# Altium schematic sheet СФ МЭИ ЛБ ПЭ2-18 11.03.04 08 Э3.SchDoc
size 420 x 297 mm; Scale: 1:1; Разраб.: Попов А.Е.; Пров.: Смолин В.А.; Номер листа: 1; Общее количество листов: 1; Наименование изделия 1: Стабилизатор напряжения; Наименование изделия 2: Схема электрическая; Наименование изделия 3: принципиальная; Нач. отд.: Нач. отд.; Литера: У; Масштаб: 1:1; Децимальный номер: СФ МЭИ ЛБ ПЭ2-18 11.03.04 08 Э3; Наименование. Строка 2: для телевизора; Наименование. Строка 3: Схема электирическая принципиальная; Наименование. Строка 1: Блок питания; Разработал: Попов А.Е.; Проверил: Смолин В.А.; Утвердил: Рассказа Д.С.; Лист. Номер: 1; Лист. Всего: 1
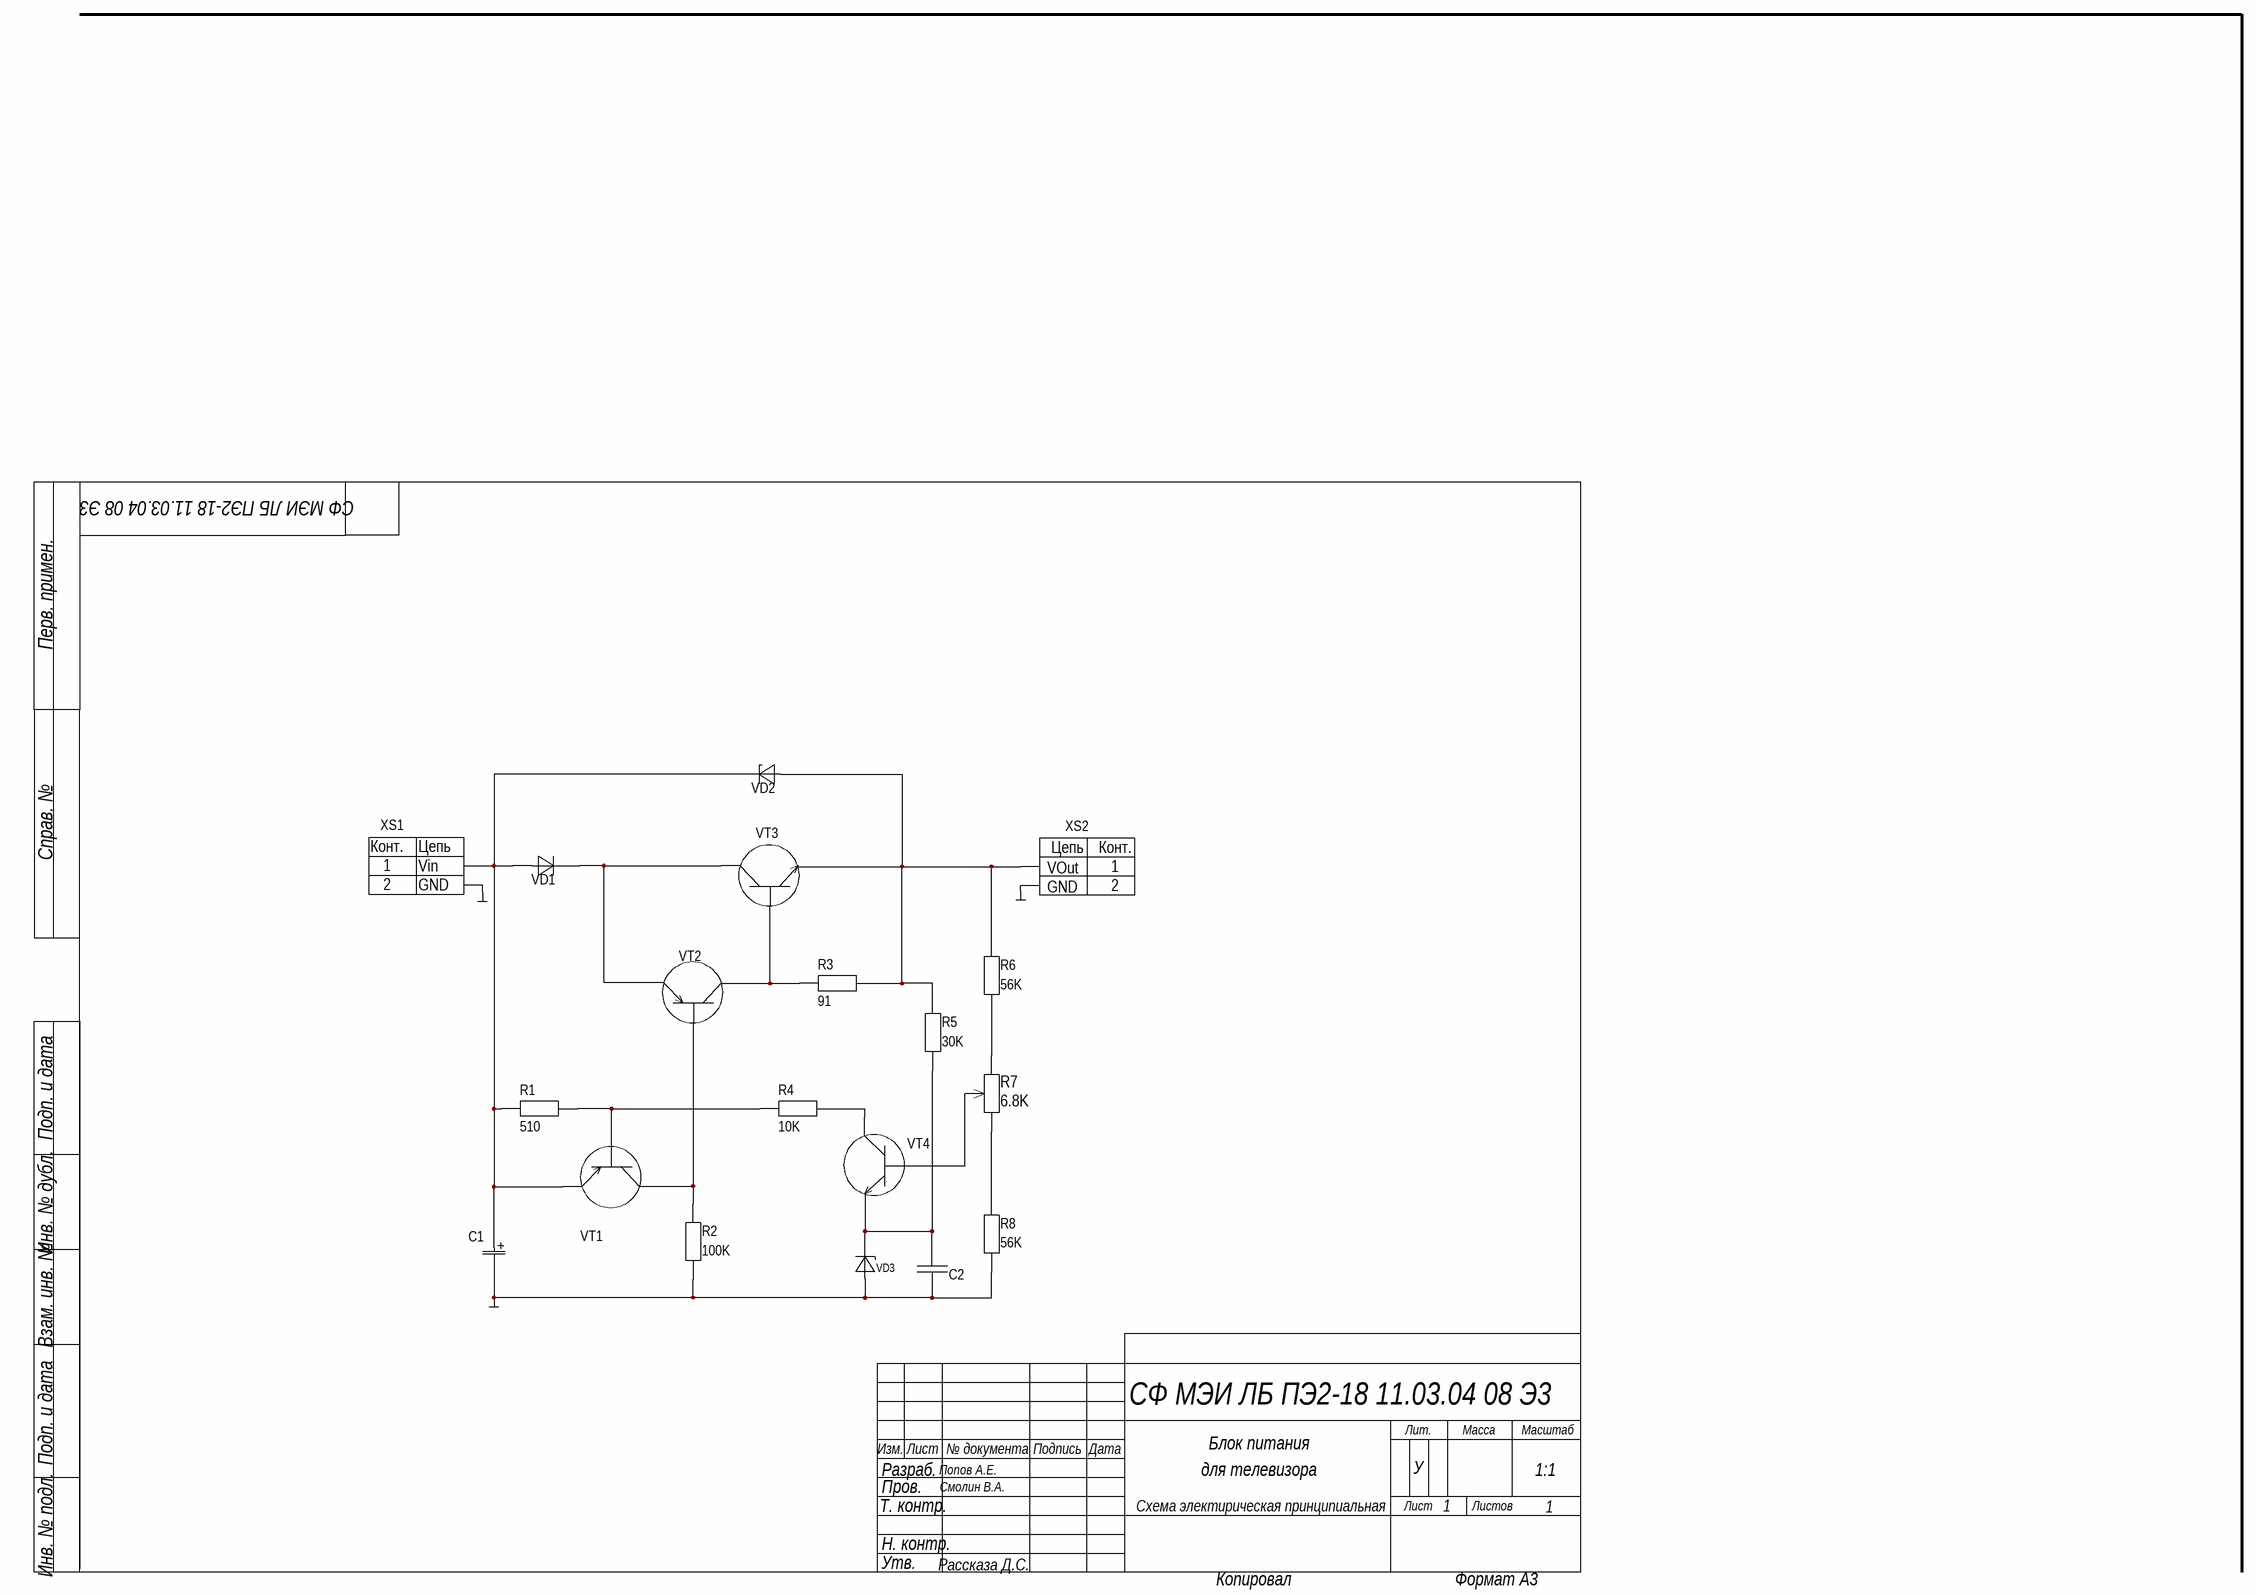
[diagram p0: СФ МЭИ ЛБ ПЭ2-18 11.03.04 08 Э3.SchDoc]

## Parts
C1  Part Number: 35TZV330M10X10.5  [CAP_J-V_10X10P5]  (value not drawn)
C2  0.068u  [0805]  (value not drawn)
R1  510  [0805]
R2  100K  [0805]
R3  91  [0805]
R4  10K  [0805]
R5  30K  [0805]
R6  56K  [0805]
R7  6.8K  [ST32]
R8  56K  [0805]
VD1  MMSZ5235B_1  [SOD-123]  (value not drawn)
VD2  MMSZ5235B  [SOD-123]  (value not drawn)
VD3  MMSZ5235B  [SOD-123]  (value not drawn)
VT1  Биполярный транзистор n-p-n  [SOT23]  (value not drawn)
VT2  Биполярный транзистор n-p-n  [SOT23]  (value not drawn)
VT3  Биполярный транзистор n-p-n  [SOT23]  (value not drawn)
VT4  Биполярный транзистор n-p-n  [SOT23]  (value not drawn)
XS1  DG126-5.0-0.2P  [DG126-5.0-02P]  (value not drawn)
XS2  DG126-5.0-0.2P  [DG126-5.0-02P]  (value not drawn)

## Nets
NetC1_2: C1.2 C2.1 R2.1 R8.1 VD3.1(In) XS1.2(Pin2) XS2.2(Pin2)
NetC1_1: C1.1 R1.1 VD1.1(In) VD2.2(Out) VT1.2(E) XS1.1(Pin1)
NetC2_2: C2.2 R5.1 VD3.2(Out) VT4.3(K)
NetR1_2: R1.2 R4.1 VT1.1(B)
NetR2_2: R2.2 VT1.3(K) VT2.1(B)
NetR3_1: R3.1 VT2.3(K) VT3.1(B)
NetR3_2: R3.2 R5.2 R6.2 VD2.1(In) VT3.3(K) XS2.1(Pin1)
NetR4_2: R4.2 VT4.2(E)
NetR6_1: R6.1 R7.2
NetR7_1: R7.1 R8.2
NetR7_3: R7.3 VT4.1(B)
NetVD1_2: VD1.2(Out) VT2.2(E) VT3.2(E)

## Notes on the sheet
- (near XS1) Vin
- (near XS2) VOut
- (near XS1) GND
- (near XS2) GND
- (near C1) C1
- Перв. примен.
- Справ. №
- Подп. и дата
- Инв. № дубл.
- Взам. инв. №
- Разраб.
- Изм.
- Лист
- № документа
- Подпись
- Дата
- Лит.
- Масса
- Масштаб
- Т. контр.
- Пров.
- Листов
- Инв. № подл.
- Н. контр.
- Утв.
- Копировал
- Формат A3
- (in symbol DG126-5.0-0.2P) Конт.; Цепь

## Library data of the parts
C1 = 35TZV330M10X10.5: No Description Available; Vendor: Rubycon Netherlands; Built_By: EMA_Cory; Type: DEV; Manufacturer_Part_Number: 35TZV330M10X10.5; Copyright: Copyright (C) 2018 Accelerated Designs. All rights reserved; RefDes: RefDes; Value: Value
C2 = К53-68"R"-25В-0.068 мкФ ±10% 0805: К53-68"R"-25В-0.068 мкФ ±10%
R1-R6 R8 = 0.125Вт 0805 300 Ом, 5%, Чип резистор (SMD): 0805-0.125 Вт -300 Ом±5%
R7 = 0.125Вт 0805 6.8 кОм, 5%, подстроечный чип резистор (SMD): 0805-0.125 Вт -6.8 кОм±5%
VD1 = MMSZ5235B_1: MMSZ5235B
VT1 VT2 = IRFML8244TRPBF_1: IRFML8244TRPBF
VT3 VT4 = IRFML8244TRPBF